# Altium project KR-Df-01-EL-00.PrjPcb (part 2 of 2)

## Sheet Power input.SchDoc: Name project title here
size A3; Organization: Krakul OÜ; Address1: Kaare tee 3, lubja; Address2: viimsi vald; Address3: harju maakond; Address4: Estonia 74010; DocumentNumber: No here; Revision: 0; SheetNumber: 4; SheetTotal: 7
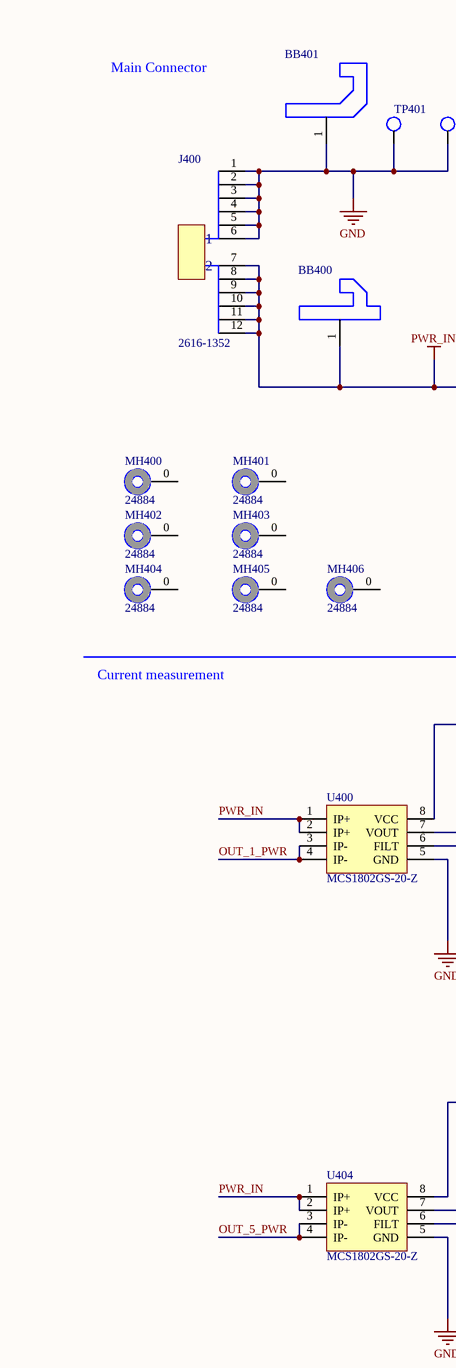
[diagram p3: Power input.SchDoc, left]
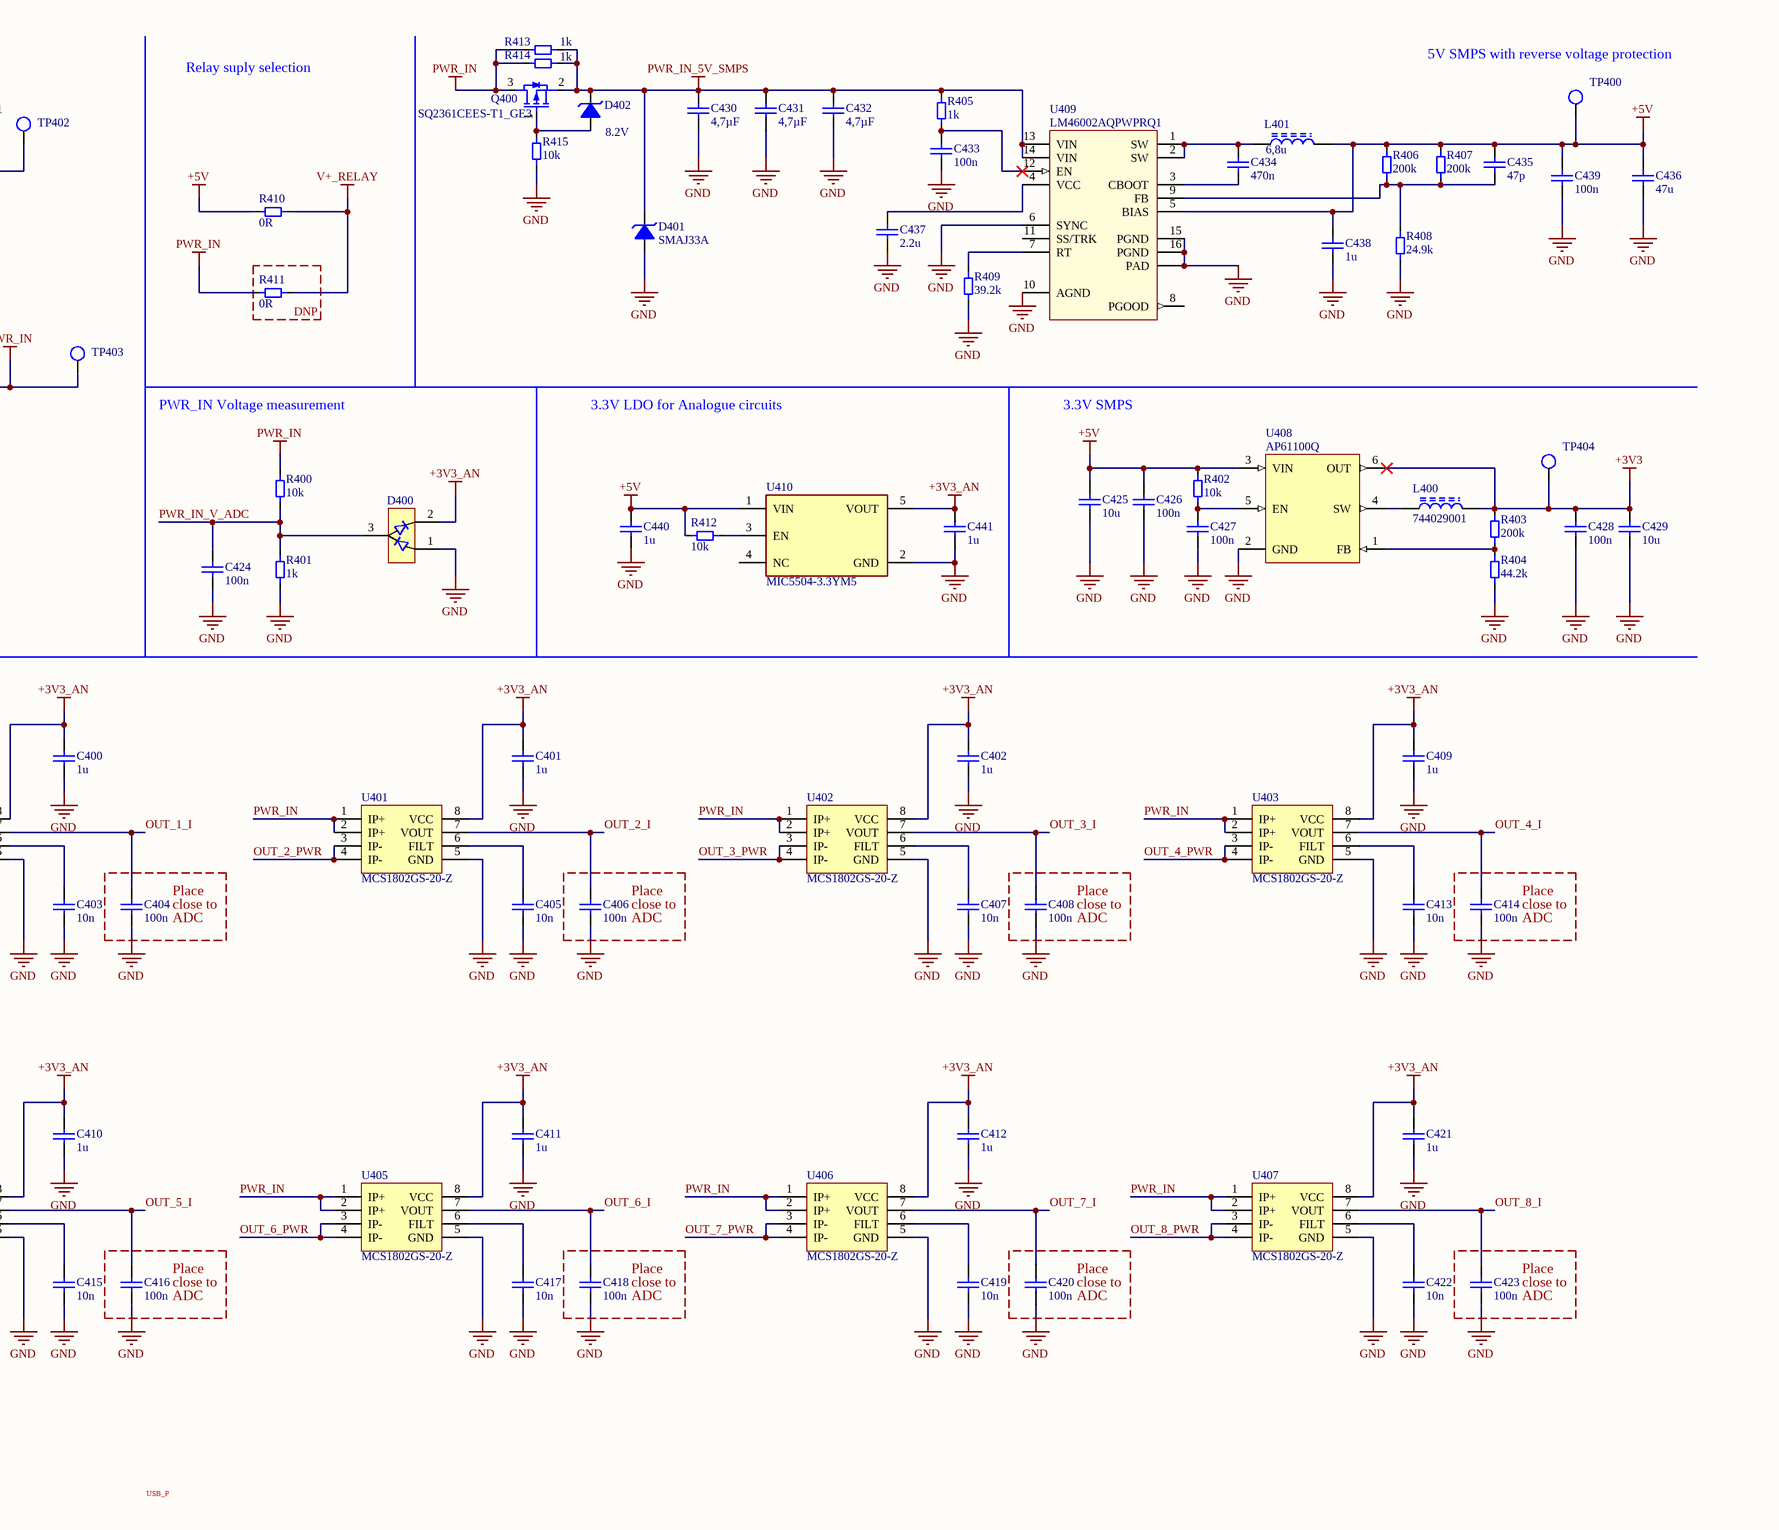
[diagram p4: Power input.SchDoc, right]

### Parts
BB400  Kr-Df-01 PWR BUSBAR  [Kr-Df-01 PWR BUSBAR footprint]  (value not drawn)
BB401  KR-Df-01 GND BUSBAR  [KR-Df-01 GND BUSBAR-Footprint-1]  (value not drawn)
C400  1u  [MLCC_0603_M]
C401  1u  [MLCC_0603_M]
C402  1u  [MLCC_0603_M]
C403  10n  [MLCC_0402_M]
C404  100n  [MLCC_0402_M]
C405  10n  [MLCC_0402_M]
C406  100n  [MLCC_0402_M]
C407  10n  [MLCC_0402_M]
C408  100n  [MLCC_0402_M]
C409  1u  [MLCC_0603_M]
C410  1u  [MLCC_0603_M]
C411  1u  [MLCC_0603_M]
C412  1u  [MLCC_0603_M]
C413  10n  [MLCC_0402_M]
C414  100n  [MLCC_0402_M]
C415  10n  [MLCC_0402_M]
C416  100n  [MLCC_0402_M]
C417  10n  [MLCC_0402_M]
C418  100n  [MLCC_0402_M]
C419  10n  [MLCC_0402_M]
C420  100n  [MLCC_0402_M]
C421  1u  [MLCC_0603_M]
C422  10n  [MLCC_0402_M]
C423  100n  [MLCC_0402_M]
C424  100n  [MLCC_0402_M]
C425  10u  [MLCC_0603_M]
C426  100n  [MLCC_0402_M]
C427  100n  [MLCC_0402_M]
C428  100n  [MLCC_0402_M]
C429  10u  [MLCC_0603_M]
C430  value 4,7µF  [MLCC_1210_M]  (hidden comment: 4.7u)
C431  value 4,7µF  [MLCC_1210_M]  (hidden comment: 4.7u)
C432  value 4,7µF  [MLCC_1210_M]  (hidden comment: 4.7u)
C433  100n  [MLCC_0402_M]
C434  470n  [MLCC_0402_M]
C435  47p  [MLCC_0402_M]
C436  47u  [MLCC_1206_M]
C437  2.2u  [MLCC_0603_M]
C438  1u  [MLCC_0603_M]
C439  100n  [MLCC_0402_M]
C440  1u  [MLCC_0603_M]
C441  1u  [MLCC_0603_M]
D400  BAT6404WH6327XTSA1  [SOT323, SC70]  (value not drawn)
D401  SMAJ33A  [FP-SMAJ-MFG]
D402  Zener Voltage: 8.2V  [SOD-323]  (hidden comment: MM3Z8V2ST1G)
J400  2616-1352  [2616-1352-Footprint-1]
L400  744029001  [744029001]
L401  value 6,8u  [SRP0420-6R8K-Footprint-1]  (hidden comment: SRP0420-6R8K)
MH400  24884  [24884-Footprint-1]
MH401  24884  [24884-Footprint-1]
MH402  24884  [24884-Footprint-1]
MH403  24884  [24884-Footprint-1]
MH404  24884  [24884-Footprint-1]
MH405  24884  [24884-Footprint-1]
MH406  24884  [24884-Footprint-1]
Q400  SQ2361CEES-T1_GE3  [3-CPH]
R400  10k  [Resistor_0603_M]
R401  1k  [Resistor_0603_M]
R402  10k  [Resistor_0603_M]
R403  200k  [Resistor_0603_M]
R404  44.2k  [Resistor_0603_M]
R405  1k  [Resistor_0402_M]
R406  200k  [Resistor_0603_M]
R407  200k  [Resistor_0603_M]
R408  24.9k  [Resistor_0402_M]
R409  39.2k  [Resistor_0402_M]
R410  Value 2: 0R  [TLRZ2BTTD-Footprint-1]  (hidden comment: TLRZ2BTTD)
R411  Value 2: 0R  [TLRZ2BTTD-Footprint-1]  (hidden comment: TLRZ2BTTD)
R412  10k  [Resistor_0603_M]
R413  1k  [Resistor_0402_M]
R414  1k  [Resistor_0402_M]
R415  10k  [Resistor_0603_M]
TP400  Testpoint 1mm  [Testpoint 1mm]  (value not drawn)  (no BOM)
TP401  Testpoint 1mm  [Testpoint 1mm]  (value not drawn)  (no BOM)
TP402  Testpoint 1mm  [Testpoint 1mm]  (value not drawn)  (no BOM)
TP403  Testpoint 1mm  [Testpoint 1mm]  (value not drawn)  (no BOM)
TP404  Testpoint 1mm  [Testpoint 1mm]  (value not drawn)  (no BOM)
U400  MCS1802GS-20-Z  [MCS1802GS-20-Z -Footprint-1]
U401  MCS1802GS-20-Z  [MCS1802GS-20-Z -Footprint-1]
U402  MCS1802GS-20-Z  [MCS1802GS-20-Z -Footprint-1]
U403  MCS1802GS-20-Z  [MCS1802GS-20-Z -Footprint-1]
U404  MCS1802GS-20-Z  [MCS1802GS-20-Z -Footprint-1]
U405  MCS1802GS-20-Z  [MCS1802GS-20-Z -Footprint-1]
U406  MCS1802GS-20-Z  [MCS1802GS-20-Z -Footprint-1]
U407  MCS1802GS-20-Z  [MCS1802GS-20-Z -Footprint-1]
U408  AP61100Q  [SOT-5X3]
U409  LM46002AQPWPRQ1  [HTSSOP-16]
U410  MIC5504-3.3YM5  [FP-SOT23-5LD-PL-1-IPC_A]

### Blocks framed on the sheet
DNP: R411

### Nets
+3V3: C428.2 C429.2 L400.2 R403.2 TP404.1 U408.6(OUT)
+3V3_AN: C400.2 C401.2 C402.2 C409.2 C410.2 C411.2 C412.2 C421.2 C441.2 D400.2 U400.8(VCC) U401.8(VCC) U402.8(VCC) U403.8(VCC) U404.8(VCC) U405.8(VCC) U406.8(VCC) U407.8(VCC) U410.5(VOUT)
+5V: C425.2 C426.2 C435.2 C436.2 C438.2 C439.2 C440.2 L401.2 R402.2 R406.2 R407.2 R410.2 R412.2 TP400.1 U408.3(VIN) U409.5(BIAS) U410.1(VIN)
GND: BB401.1(GND) C400.1 C401.1 C402.1 C403.1 C404.1 C405.1 C406.1 C407.1 C408.1 C409.1 C410.1 C411.1 C412.1 C413.1 C414.1 C415.1 C416.1 C417.1 C418.1 C419.1 C420.1 C421.1 C422.1 C423.1 C424.1 C425.1 C426.1 C427.1 C428.1 C429.1 C430.2 C431.2 C432.2 C433.2 C436.1 C437.1 C438.1 C439.1 C440.1 C441.1 D400.1 D401.2(A) J400.1 J400.2 J400.3 J400.4 J400.5 J400.6 R401.1 R404.1 R408.1 R409.1 R415.1 TP401.1 TP402.1 U400.5(GND) U401.5(GND) U402.5(GND) U403.5(GND) U404.5(GND) U405.5(GND) U406.5(GND) U407.5(GND) U408.2(GND) U409.6(SYNC) U409.10(AGND) U409.15(PGND) U409.16(PGND) U409.17(PAD) U410.2(GND)
PWR_IN: BB400.1 J400.7 J400.8 J400.9 J400.10 J400.11 J400.12 Q400.3(D) R400.2 R411.2 R413.2 R414.2 TP403.1 U400.1(IP+) U400.2(IP+) U401.1(IP+) U401.2(IP+) U402.1(IP+) U402.2(IP+) U403.1(IP+) U403.2(IP+) U404.1(IP+) U404.2(IP+) U405.1(IP+) U405.2(IP+) U406.1(IP+) U406.2(IP+) U407.1(IP+) U407.2(IP+)
PWR_IN_5V_SMPS: C430.1 C431.1 C432.1 D401.1(C) D402.1(C) Q400.2(S) R405.2 R413.1 R414.1 U409.13(VIN) U409.14(VIN)
V+_RELAY: R410.1 R411.1
OUT_1_I: C404.2 U400.7(VOUT)
OUT_1_PWR: U400.3(IP-) U400.4(IP-)
OUT_2_I: C406.2 U401.7(VOUT)
OUT_2_PWR: U401.3(IP-) U401.4(IP-)
OUT_3_I: C408.2 U402.7(VOUT)
OUT_3_PWR: U402.3(IP-) U402.4(IP-)
OUT_4_I: C414.2 U403.7(VOUT)
OUT_4_PWR: U403.3(IP-) U403.4(IP-)
OUT_5_I: C416.2 U404.7(VOUT)
OUT_5_PWR: U404.3(IP-) U404.4(IP-)
OUT_6_I: C418.2 U405.7(VOUT)
OUT_6_PWR: U405.3(IP-) U405.4(IP-)
OUT_7_I: C420.2 U406.7(VOUT)
OUT_7_PWR: U406.3(IP-) U406.4(IP-)
OUT_8_I: C423.2 U407.7(VOUT)
OUT_8_PWR: U407.3(IP-) U407.4(IP-)
PWR_IN_V_ADC: C424.2 D400.3 R400.1 R401.2
NetC403_2: C403.2 U400.6(FILT)
NetC405_2: C405.2 U401.6(FILT)
NetC407_2: C407.2 U402.6(FILT)
NetC413_2: C413.2 U403.6(FILT)
NetC415_2: C415.2 U404.6(FILT)
NetC417_2: C417.2 U405.6(FILT)
NetC419_2: C419.2 U406.6(FILT)
NetC422_2: C422.2 U407.6(FILT)
NetC427_2: C427.2 R402.1 U408.5(EN)
NetC433_1: C433.1 R405.1 U409.12(EN)
NetC434_1: C434.1 U409.3(CBOOT)
NetC434_2: C434.2 L401.1 U409.1(SW) U409.2(SW)
NetC435_1: C435.1 R406.1 R407.1 R408.2 U409.9(FB)
NetC437_2: C437.2 U409.4(VCC)
NetD402_2: D402.2(A) Q400.1(G) R415.2
NetL400_1: L400.1 U408.4(SW)
NetR403_1: R403.1 R404.2 U408.1(FB)
NetR409_2: R409.2 U409.7(RT)
NetR412_1: R412.1 U410.3(EN)

Not connected (* = marked no-connect by the designer): MH400 0(MH?); MH401 0(MH?); MH402 0(MH?); MH403 0(MH?); MH404 0(MH?); MH405 0(MH?); MH406 0(MH?); U409 8(PGOOD) 11(SS/TRK); U410 4(NC)

### Notes on the sheet
- Main Connector
- Relay suply selection
- (near TP400) 5V SMPS with reverse voltage protection
- PWR_IN Voltage measurement
- 3.3V LDO for Analogue circuits
- 3.3V SMPS
- Current measurement
- (near C404) Place
- (near C404) close to
- (near C404) ADC
- (near C406) Place
- (near C406) close to
- (near C406) ADC
- (near C408) Place
- (near C408) close to
- (near C408) ADC
- (near C414) Place
- (near C414) close to
- (near C414) ADC
- (near C416) Place
- (near C416) close to
- (near C416) ADC
- (near C418) Place
- (near C418) close to
- (near C418) ADC
- (near C420) Place
- (near C420) close to
- (near C420) ADC
- (near C423) Place
- (near C423) close to
- (near C423) ADC
- USB_P
- Title:
- Date:
- Last modified:
- Project:
- Sheet
- Time:
- of
- Size:
- A3
- Engineer:
- Revision:
- Revision date:
- Checked by:

### Library data of the parts
BB400 = CMP-ROOT-01072-9: Custom PWR busbar for DefSecIntel fuse board.; Manufacturer: Krakul; Part number: PWR_BUSBAR_1; Case/Package: Custom busbar; Mount: SMD; Pins: 1; RoHS: Yes
BB401 = CMP-ROOT-01092-5: Custom GND busbar for DefSecIntel fuse board; Manufacturer: Krakul; Part number: GND_BUSBAR_1; Case/Package: Custom busbar; Mount: SMD; Pins: 1; RoHS: Yes
C400-C402 C409-C412 C421 C438 C440 C441 = CMP-001-0642-2: MLCC, 0603, 1u, 10%, 10V, X7R; Manufacturer: Any; Capacitor Type: Ceramic; Value: 1µF; Mount: SMD; Tolerance: 10%; Case/Package: 0603; Part number: MLCC, 0603, 1u, 10%, 10V, X7R; RoHS: Yes; Voltage: 10V; Dielectric: X7R
C403 C405 C407 C413 C415 C417 C419 C422 = CMP-0001-00209-2: MLCC, 0402, 10n, 10%, 50V, X5R; Manufacturer: Any; Value: 10nF; Capacitor Type: Ceramic; Dielectric: X5R; Case/Package: 0402; Mount: SMD; Voltage: 50V; Part number: MLCC, 0402, 10n, 10%, 50V, X5R; Tolerance: 10%; RoHS: Yes
C404 C406 C408 C414 C416 C418 C420 C423 C424 C426-C428 C439 = CMP-001-1256-2: as C103 on sheet Power outputs; Case/Package: 0402; Part number: MLCC, 0402, 100n, 10%, 10V, X5R; RoHS: Yes; Tolerance: 10%; Mount: SMD; Voltage: 10V; Dielectric: X5R
C425 C429 = CMP-001-1355-1: MLCC, 0603, 10u, 10%, 25V, X5R; Manufacturer: Any; Value: 10µF; Capacitor Type: Ceramic; Voltage: 25V; Dielectric: X5R; Case/Package: 0603; Part number: MLCC, 0603, 10u, 10%, 25V, X5R; RoHS: Yes; Mount: SMD
C430-C432 = CMP-001-1296-1: MLCC, 1210, 4.7u, 10%, 100V, X7S; Manufacturer: Any; Capacitor Type: Ceramic; Capacitance: 4.7uF; Voltage Rating: 100V; Case Code (Metric): 3225; Case/Package: 1210; Min Operating Temperature: -55°C; Voltage: 100V; Mount: Surface Mount; Tolerance: 10%; Part number: MLCC, 1210, 4.7u, 10%, 100V, X7S; Packaging: Tape and Reel; Case Code (Imperial): 1210; RoHS: Yes; Dielectric: X7S; Max Operating Temperature: 125°C
C433 = CMP-0001-00196-2: MLCC, 0402, 100n, 10%, 50V, X7R; Manufacturer: Any; Value: 100nF; Capacitor Type: Ceramic; Part number: MLCC, 0402, 100n, 10%, 50V, X7R; Mount: SMD; Voltage: 50V; RoHS: Yes; Dielectric: X7R; Tolerance: 10%; Case/Package: 0402
C434 = CMP-0001-00217-2: MLCC, 0402, 470n, 10%, 50V, X5R; Manufacturer: Any; Capacitor Type: Ceramic; Value: 470nF; Dielectric: X5R; Mount: SMD; RoHS: Yes; Case/Package: 0402; Part number: MLCC, 0402, 470n, 10%, 50V, X5R; Voltage: 50V; Tolerance: 10%
C435 = CMP-0001-00149-2: MLCC, 0402, 47p, 10%, 50V, X7R; Manufacturer: Any; Capacitor Type: Ceramic; Value: 47pF; Tolerance: 10%; Case/Package: 0402; Dielectric: X7R; Mount: SMD; Voltage: 50V; RoHS: Yes; Part number: MLCC, 0402, 47p, 10%, 50V, X7R
C436 = CMP-001-1106-2: MLCC, 1206, 47u, 10%, 10V, X5R; Manufacturer: Any; Value: 47µF; Capacitor Type: Ceramic; Dielectric: X5R; Mount: SMD; Part number: MLCC, 1206, 47u, 10%, 10V, X5R; Tolerance: 10%; RoHS: Yes; Case/Package: 1206; Voltage: 10V
C437 = CMP-001-1459-1: MLCC, 0603, 2.2u, 10%, 16V, X5R; Manufacturer: Any; Capacitor Type: Ceramic; Value: 2.2µF; RoHS: Yes; Dielectric: X5R; Part number: MLCC, 0603, 2.2u, 10%, 16V, X5R; Case/Package: 0603; Tolerance: 10%; Voltage: 16V; Mount: SMD
D400 = CMP-ROOT-00071-1: Diode Array 1 Pair Series Connection Schottky 40V 120mA Surface Mount SC-70, SOT-323; Manufacturer: Infineon; Peak Non-Repetitive Surge Current: 800mA; Forward Current: 250mA; Forward Voltage: 750mV; Reverse Recovery Time: 5ns; RoHS: Yes; Radiation Hardening: No; Halogen Free: Halogen Free; Case/Package: SOT-323; Number of Pins: 3; Max Reverse Voltage (DC): 40V; Max Repetitive Reverse Voltage (Vrrm): 40V; Mount: Surface Mount; Average Rectified Current: 120mA; Max Operating Temperature: 150°C; Lead Free: Lead Free; Min Operating Temperature: -55°C; Part number: BAT6404WH6327XTSA1; Packaging: Tape and Reel; Pins: 3
D401 = CMP-ROOT-01076-1: SMAJ Series 53.3 V 0.4 kW Surface Mount Uni-Directional TVS Diode - DO-214AC; Manufacturer: Littelfuse; Clamping Voltage: 53.3V; Diode Type: ZENER; Direction: Unidirectional; Leakage Current: 1uA; Max Breakdown Voltage: 40.6V; Max Power Dissipation: 3.3W; Min Breakdown Voltage: 36.7V; Number of Elements: 1; Peak Pulse Current: 7.5A; Peak Pulse Power: 400W; Power Line Protection: No; Reverse Standoff Voltage: 33V; Test Current: 1mA; Case/Package: DO-214AC; Mount: SMD; Part number: SMAJ33A; Pins: 2; RoHS: Yes; Clamping Voltage-Max: 53.3V; Height: 2.087mm; Lead Free: Lead Free; Length: 4.5mm; Max Operating Temperature: 150°C; Max Reverse Leakage Current: 1uA; Min Operating Temperature: -65°C; Mounting Technology: Surface Mount; Number of Unidirectional Channels: 1; Packaging: Tape and Reel; Polarity: Unidirectional; Power Dissipation: 400W; Reach SVHC Compliant: Unknown; Reverse Breakdown Voltage: 36.7V; RoHS Compliant: Yes; Series: SMAJ; Voltage Rating (DC): 33V; Width: 2.79mm
D402 = CMP-ROOT-00931-1: MM3Z8V2ST1 Series 200 mW 10 mA 8.2 V SMT Zener Voltage Regulator - SOD-323; Manufacturer: onsemi; Element Configuration: Single; Forward Voltage: 900mV; Impedance: 15R; Material: Plastic; Max Power Dissipation: 200mW; Max Reverse Current: 700nA; Test Current: 5mA; Tolerance: 2%; Zener Current: 10mA; Case/Package: SOD-323-2; Mount: SMD; Part number: MM3Z8V2ST1G; RoHS: Yes; Height: 1mm; Lead Free: Lead Free; Length: 1.8mm; Max Operating Temperature: 150°C; Max Reverse Leakage Current: 700nA; Min Operating Temperature: -65°C; Number of Pins: 2; Package Quantity: 3000; Packaging: Tape and Reel; Power Dissipation: 200mW; Power Rating: 200mW; Radiation Hardening: No; Reach SVHC Compliant: Yes; RoHS Compliant: Yes; Series: -; Voltage Rating (DC): 8.2V; Voltage Tolerance: 2%; Width: 1.35mm; Working Voltage: 8.2V
J400 = CMP-ROOT-01061-1: Lever actuated terminal block, Wire-to-board. 78A, 300V, 4-18 AWG; Manufacturer: WAGO; Mount: TH; Part number: 2616-1352; Pins: 2; RoHS: Yes; Housing Color: Grey
L400 = CMP-ROOT-00305-1: 1µH Shielded Wirewound Inductor 2.2A 55mOhm Max Nonstandard; Manufacturer: Wurth Electronics Inc.; DC Resistance (DCR): 55mR; Inductance: 1uH; Value: 1uH; Test Frequency: 100kHz; Inductance Tolerance: 30%; Saturation Current: 1.6A; Self Resonant Frequency: 150MHz; Core Material: Ferrite; Max DC Current: 2.5A; RoHS: Yes; Number of Pins: 2; Width: 2.8mm; Height: 1.35mm; Length: 2.8mm; Current Rating: 2.2A; Termination: SMD/SMT; Packaging: Cut Tape; Height - Seated (Max): 0.059inch; Part number: 744029001; Composition: Wirewound; Case/Package: Nonstandard; Depth: 2.8mm; Mount: Surface Mount; REACH SVHC: Unknown; RMS Current (Irms): 2.2A; Package Quantity: 1200; Weight: 0.001129oz; Max Operating Temperature: 125°C; Min Operating Temperature: -40°C; Tolerance: 30%; Shielding: Shielded
L401 = CMP-ROOT-01075-2: Inductor Power Shielded Wirewound 6.8uH 10% 100KHz 27Q-Factor Metal Alloy Powder 2.6A 0.117Ohm DCR T/R; Manufacturer: Bourns; Case/Package: 4x4mm; Mount: SMD; Part number: SRP0420-6R8K; Pins: 2; RoHS: Yes
MH400-MH406 = CMP-ROOT-01125-5: Standoffs & Spacers SM Standoff Steel 650 pcs per reel; Manufacturer: Keystone Electronics; Plating: Tin; Threaded/Unthreaded: Threaded; Case/Package: -; Mount: SMD; Part number: 24884; RoHS: Yes; Material: Steel; Series: -
Q400 = CMP-ROOT-01117-1: P-Channel 60V 2,8A SOT-23-3; Manufacturer: Vishay; Case/Package: SOT-23-3; Mount: SMD; Part number: SQ2361CEES-T1_GE3; Pins: 3; RoHS: Yes
R400 R402 R412 R415 = CMP-001-0101-2: as R108 on sheet Power outputs; Tolerance: 1%; Value: 10k; RoHS: Yes; Mount: SMD; Case/Package: 0603; Part number: Resistor, 0603, 10k, 1%, 1/10W
R401 = CMP-0001-00237-1: as R135 on sheet Power outputs; Mount: SMD; Part number: Any; RoHS: Yes; Case/Package: 0603; Value: 1k
R403 R406 R407 = CMP-001-0132-2: Resistor, 0603, 200k, 1%, 1/10W; Manufacturer: Any; Power: 100mW; Case/Package: 0603; Mount: SMD; Part number: Resistor, 0603, 200k, 1%, 1/10W; Value: 200k; RoHS: Yes; Tolerance: 1%
R404 = CMP-001-1616-1: Resistor, 0603, 44.2k, 0.1%, 1/10W; Manufacturer: Any; Power: 100mW; RoHS: Yes; Case/Package: 0603; Mount: SMD; Value: 44.2k; Part number: Resistor, 0603, 44.2k, 0.1%, 1/10W; Tolerance: 0.1%
R405 R413 R414 = CMP-001-0340-2: Resistor, 0402, 1k, 1%, 1/16W; Manufacturer: Any; Power: 62mW; Value: 1k; Case/Package: 0402; Mount: SMD; Tolerance: 1%; RoHS: Yes; Part number: Resistor, 0402, 1k, 1%, 1/16W
R408 = CMP-0001-00027-1: Resistor, 0402, 24.9k, 1%, 1/10W; Manufacturer: Any; Case/Package: 0402; Mount: SMD; RoHS: Yes; Part number: Any; Value: 24.9k
R409 = CMP-0001-00015-2: Resistor, 0402, 39.2k, 1%, 1/10W; Manufacturer: Any; Case/Package: 0402; Value: 39.2k; Mount: SMD; Part number: Resistor, 0402, 39.2k, 1%, 1/10W; RoHS: Yes
R410 R411 = CMP-0001-00276-2: Res Metal Plate 1206 0 Ohm Sulfur Resistant Pad SMD Automotive T/R; Manufacturer: KOA Speer Electronics; Current: 50A; Value: 0; Case/Package: 1206; Mount: SMD; Part number: TLRZ2BTTD; Pins: 2; RoHS: Yes; Case Code (Imperial): 1206; Case Code (Metric): 3216; Features: Automotive AEC-Q200; Max Operating Temperature: 170°C; Min Operating Temperature: -55°C; Number of Terminations: 2; Packaging: Cut Tape; Ratings: AEC-Q200; RoHS Compliant: Yes; Series: TLRZ
TP400-TP404 = CMP-001-1238-1
U400-U407 = CMP-ROOT-01063-2: Hall Effect-Based Linear Current Sensor IC ±20A 66mV/A 100kHz 8-Pin SOIC T/R; Manufacturer: MPS; Case/Package: SOIC-8; Mount: SMD; Part number: MCS1802GS-20-Z; Pins: 8; RoHS: Yes; Sensitivity: 66mV/A
U408 = CMP-ROOT-00784-1: Switching Voltage Regulators DCDC Conv LV Buck SOT563 T&R 3K; Part number: AP61102Z6-7; Manufacturer: Diodes Incorporated; Mount: SMD; Case/Package: SOT-563-6; RoHS: Yes
U409 = CMP-ROOT-00198-2: Manufacturer: Texas Instruments; Min Output Voltage: 1V; Min Input Voltage: 3.5V; Output Type: Adjustable; Output Current: 2A; Number of Outputs: 1; Switching Frequency: 2.2MHz; Max Input Voltage: 60V; Synchronous Rectifier: Yes; Output Configuration: Positive; Max Output Voltage: 28V; Packaging: Tape and Reel; Min Operating Temperature: -40°C; RoHS: Yes; Part number: LM46002AQPWPRQ1; Pins: 16; Mount: Surface Mount; Case/Package: 16HTSSOP; Max Operating Temperature: 125°C
U410 = CMP-ROOT-00999-4: 3.3V 300mA LDO; Manufacturer: Microchip Technology; Case/Package: SOT23-5; Mount: SMD; Part number: MIC5504-3.3YM5; Pins: 5; RoHS: Yes

## Sheet MCU.SchDoc: Name project title here
size A3; Organization: Krakul OÜ; Address1: Kaare tee 3, lubja; Address2: viimsi vald; Address3: harju maakond; Address4: Estonia 74010; DocumentNumber: No here; Revision: 0; SheetNumber: 5; SheetTotal: 7
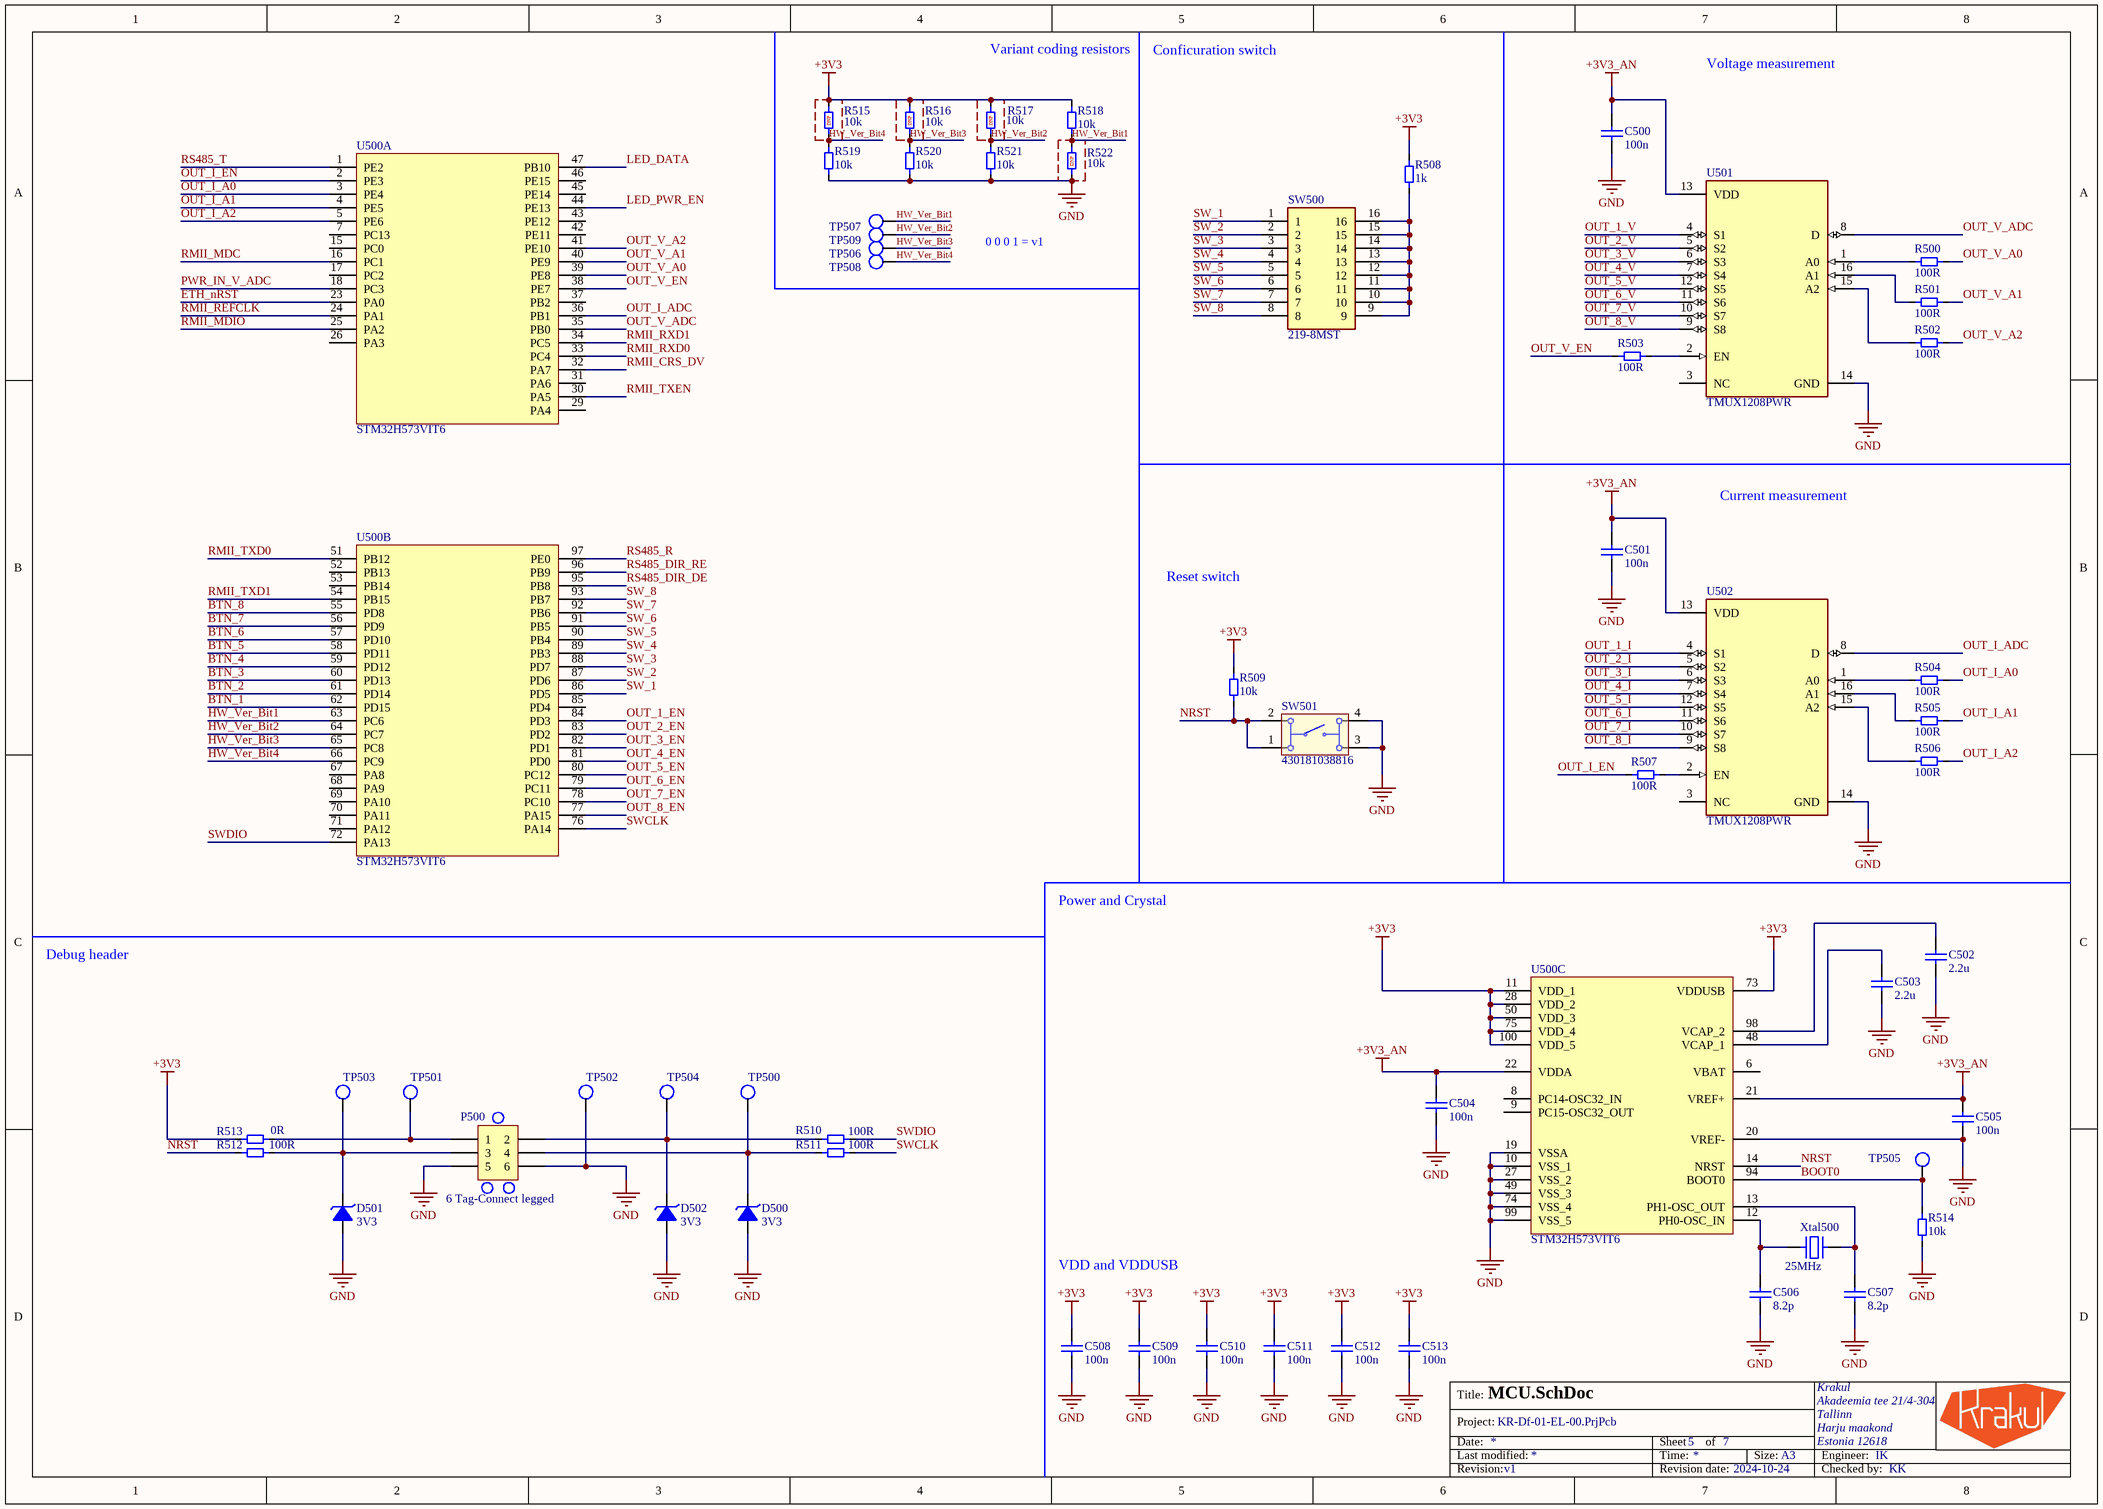
[diagram p5: MCU.SchDoc]

### Parts
C500  100n  [MLCC_0402_M]
C501  100n  [MLCC_0402_M]
C502  2.2u  [MLCC_0603_M]
C503  2.2u  [MLCC_0603_M]
C504  100n  [MLCC_0402_M]
C505  100n  [MLCC_0402_M]
C506  8.2p  [MLCC_0402_M]
C507  8.2p  [MLCC_0402_M]
C508  100n  [MLCC_0402_M]
C509  100n  [MLCC_0402_M]
C510  100n  [MLCC_0402_M]
C511  100n  [MLCC_0402_M]
C512  100n  [MLCC_0402_M]
C513  100n  [MLCC_0402_M]
D500  3V3  [SOD-923]
D501  3V3  [SOD-923]
D502  3V3  [SOD-923]
P500  6 Tag-Connect legged  [6P TAG-CONN legged]
R500  100R  [Resistor_0603_M]
R501  100R  [Resistor_0603_M]
R502  100R  [Resistor_0603_M]
R503  100R  [Resistor_0603_M]
R504  100R  [Resistor_0603_M]
R505  100R  [Resistor_0603_M]
R506  100R  [Resistor_0603_M]
R507  100R  [Resistor_0603_M]
R508  1k  [Resistor_0603_M]
R509  10k  [Resistor_0603_M]
R510  100R  [Resistor_0603_M]
R511  100R  [Resistor_0603_M]
R512  100R  [Resistor_0603_M]
R513  Value 2: 0R  [TLRZ2BTTD-Footprint-1]  (hidden comment: TLRZ2BTTD)
R514  10k  [Resistor_0603_M]
R515  10k  [Resistor_0603_M]
R516  10k  [Resistor_0603_M]
R517  10k  [Resistor_0603_M]
R518  10k  [Resistor_0603_M]
R519  10k  [Resistor_0603_M]
R520  10k  [Resistor_0603_M]
R521  10k  [Resistor_0603_M]
R522  10k  [Resistor_0603_M]
SW500  219-8MST  [219-8MST-Footprint-1]
SW501  430181038816  [430181038816]
TP500  Testpoint 1mm  [Testpoint 1mm]  (value not drawn)  (no BOM)
TP501  Testpoint 1mm  [Testpoint 1mm]  (value not drawn)  (no BOM)
TP502  Testpoint 1mm  [Testpoint 1mm]  (value not drawn)  (no BOM)
TP503  Testpoint 1mm  [Testpoint 1mm]  (value not drawn)  (no BOM)
TP504  Testpoint 1mm  [Testpoint 1mm]  (value not drawn)  (no BOM)
TP505  Testpoint 1mm  [Testpoint 1mm]  (value not drawn)  (no BOM)
TP506  Testpoint 1mm  [Testpoint 1mm]  (value not drawn)  (no BOM)
TP507  Testpoint 1mm  [Testpoint 1mm]  (value not drawn)  (no BOM)
TP508  Testpoint 1mm  [Testpoint 1mm]  (value not drawn)  (no BOM)
TP509  Testpoint 1mm  [Testpoint 1mm]  (value not drawn)  (no BOM)
U500  STM32H573VIT6  [STM32H573VIT6-Footprint-1]  (parts A,B,C of 3)
U501  TMUX1208PWR  [FP-PW0016A-IPC_B]
U502  TMUX1208PWR  [FP-PW0016A-IPC_B]
Xtal500  Frequency: 25MHz  [4-SMD Crystal 2.00mm x 1.60mm]  (hidden comment: ECS-250-10-37B-CTN-TR)

### Nets
+3V3: C508.2 C509.2 C510.2 C511.2 C512.2 C513.2 R508.2 R509.2 R513.2 R515.1 R516.2 R517.2 R518.2 U500.11(VDD_1) U500.28(VDD_2) U500.50(VDD_3) U500.73(VDDUSB) U500.75(VDD_4) U500.100(VDD_5)
+3V3_AN: C500.2 C501.2 C504.2 C505.2 U500.21(VREF+) U500.22(VDDA) U501.13(VDD) U502.13(VDD)
GND: C500.1 C501.1 C502.1 C503.1 C504.1 C505.1 C506.1 C507.1 C508.1 C509.1 C510.1 C511.1 C512.1 C513.1 D500.2(A) D501.2(A) D502.2(A) P500.5 P500.6 R514.1 R519.1 R520.1 R521.1 R522.1 SW501.3 SW501.4 TP502.1 U500.10(VSS_1) U500.19(VSSA) U500.20(VREF-) U500.27(VSS_2) U500.49(VSS_3) U500.74(VSS_4) U500.99(VSS_5) U501.14(GND) U502.14(GND) Xtal500.2(GND) Xtal500.4(GND)
BOOT0: R514.2 TP505.1 U500.94(BOOT0)
BTN_1: U500.62(PD15)
BTN_2: U500.61(PD14)
BTN_3: U500.60(PD13)
BTN_4: U500.59(PD12)
BTN_5: U500.58(PD11)
BTN_6: U500.57(PD10)
BTN_7: U500.56(PD9)
BTN_8: U500.55(PD8)
ETH_nRST: U500.23(PA0)
HW_Ver_Bit1: R518.1 R522.2 TP507.1 U500.63(PC6)
HW_Ver_Bit2: R517.1 R521.2 TP509.1 U500.64(PC7)
HW_Ver_Bit3: R516.1 R520.2 TP506.1 U500.65(PC8)
HW_Ver_Bit4: R515.2 R519.2 TP508.1 U500.66(PC9)
LED_DATA: U500.47(PB10)
LED_PWR_EN: U500.44(PE13)
NRST: R509.1 R512.2 SW501.1 SW501.2 U500.14(NRST)
OUT_1_EN: U500.84(PD3)
OUT_1_I: U502.4(S1)
OUT_1_V: U501.4(S1)
OUT_2_EN: U500.83(PD2)
OUT_2_I: U502.5(S2)
OUT_2_V: U501.5(S2)
OUT_3_EN: U500.82(PD1)
OUT_3_I: U502.6(S3)
OUT_3_V: U501.6(S3)
OUT_4_EN: U500.81(PD0)
OUT_4_I: U502.7(S4)
OUT_4_V: U501.7(S4)
OUT_5_EN: U500.80(PC12)
OUT_5_I: U502.12(S5)
OUT_5_V: U501.12(S5)
OUT_6_EN: U500.79(PC11)
OUT_6_I: U502.11(S6)
OUT_6_V: U501.11(S6)
OUT_7_EN: U500.78(PC10)
OUT_7_I: U502.10(S7)
OUT_7_V: U501.10(S7)
OUT_8_EN: U500.77(PA15)
OUT_8_I: U502.9(S8)
OUT_8_V: U501.9(S8)
OUT_I_A0: R504.2 U500.3(PE4)
OUT_I_A1: R505.2 U500.4(PE5)
OUT_I_A2: R506.2 U500.5(PE6)
OUT_I_ADC: U500.36(PB1) U502.8(D)
OUT_I_EN: R507.1 U500.2(PE3)
OUT_V_A0: R500.2 U500.39(PE8)
OUT_V_A1: R501.2 U500.40(PE9)
OUT_V_A2: R502.2 U500.41(PE10)
OUT_V_ADC: U500.35(PB0) U501.8(D)
OUT_V_EN: R503.1 U500.38(PE7)
PWR_IN_V_ADC: U500.18(PC3)
RMII_CRS_DV: U500.32(PA7)
RMII_MDC: U500.16(PC1)
RMII_MDIO: U500.25(PA2)
RMII_REFCLK: U500.24(PA1)
RMII_RXD0: U500.33(PC4)
RMII_RXD1: U500.34(PC5)
RMII_TXD0: U500.51(PB12)
RMII_TXD1: U500.54(PB15)
RMII_TXEN: U500.30(PA5)
RS485_DIR_DE: U500.95(PB8)
RS485_DIR_RE: U500.96(PB9)
RS485_R: U500.97(PE0)
RS485_T: U500.1(PE2)
SW_1: SW500.1 U500.86(PD5)
SW_2: SW500.2 U500.87(PD6)
SW_3: SW500.3 U500.88(PD7)
SW_4: SW500.4 U500.89(PB3)
SW_5: SW500.5 U500.90(PB4)
SW_6: SW500.6 U500.91(PB5)
SW_7: SW500.7 U500.92(PB6)
SW_8: SW500.8 U500.93(PB7)
SWCLK: R511.1 U500.76(PA14)
SWDIO: R510.2 U500.72(PA13)
NetC502_2: C502.2 U500.98(VCAP_2)
NetC503_2: C503.2 U500.48(VCAP_1)
NetC506_2: C506.2 U500.12(PH0-OSC_IN) Xtal500.1
NetC507_2: C507.2 U500.13(PH1-OSC_OUT) Xtal500.3
NetD500_1: D500.1(C) P500.4 R511.2 TP500.1
NetD501_1: D501.1(C) P500.3 R512.1 TP503.1
NetD502_1: D502.1(C) P500.2 R510.1 TP504.1
NetP500_1: P500.1 R513.1 TP501.1
NetR500_1: R500.1 U501.1(A0)
NetR501_1: R501.1 U501.16(A1)
NetR502_1: R502.1 U501.15(A2)
NetR503_2: R503.2 U501.2(EN)
NetR504_1: R504.1 U502.1(A0)
NetR505_1: R505.1 U502.16(A1)
NetR506_1: R506.1 U502.15(A2)
NetR507_2: R507.2 U502.2(EN)
NetR508_1: R508.1 SW500.9 SW500.10 SW500.11 SW500.12 SW500.13 SW500.14 SW500.15 SW500.16

Not connected (* = marked no-connect by the designer): U500 6(VBAT) 7(PC13) 8(PC14-OSC32_IN) 9(PC15-OSC32_OUT) 15(PC0) 17(PC2) 26(PA3) 29(PA4) 31(PA6) 37(PB2) 42(PE11) 43(PE12) 45(PE14) 46(PE15) 52(PB13) 53(PB14) 67(PA8) 68(PA9) 69(PA10) 70(PA11) 71(PA12) 85(PD4); U501 3(NC); U502 3(NC)

### Notes on the sheet
- Variant coding resistors
- Conficuration switch
- Voltage measurement
- (near R515) DNP
- (near R516) DNP
- (near R517) DNP
- (near R522) DNP
- 0 0 0 1 = v1
- Current measurement
- Reset switch
- Power and Crystal
- Debug header
- VDD and VDDUSB
- Title:
- Date:
- Last modified:
- Project:
- Sheet
- Time:
- of
- Size:
- A3
- Engineer:
- Revision:
- Revision date:
- Checked by:

### Library data of the parts
C500 C501 C504 C505 C508-C513 = CMP-001-1256-2: as C103 on sheet Power outputs; Case/Package: 0402; Part number: MLCC, 0402, 100n, 10%, 10V, X5R; RoHS: Yes; Tolerance: 10%; Mount: SMD; Voltage: 10V; Dielectric: X5R
C502 C503 = CMP-001-1459-1: as C437 on sheet Power input; RoHS: Yes; Dielectric: X5R; Part number: MLCC, 0603, 2.2u, 10%, 16V, X5R; Case/Package: 0603; Tolerance: 10%; Voltage: 16V; Mount: SMD
C506 C507 = CMP-0001-00091-2: MLCC, 0402, 8.2p, 5%, 50V, C0G/NP0; Manufacturer: Any; Value: 8.2pF; Capacitor Type: Ceramic; Part number: MLCC, 0402, 8.2p, 5%, 50V, C0G/NP0; Voltage: 50V; Mount: SMD; Tolerance: 5%; Case/Package: 0402; RoHS: Yes; Dielectric: C0G/NP0
D500-D502 = CMP-001-1298-2: TVS DIODE 3.3V SOD923; Part number: ESD9X3.3ST5G; Manufacturer: ON Semiconductor; Number of Channels: 1; Polarity: Unidirectional; Clamping Voltage: 10.4V; Test Current: 1mA; Element Configuration: Single; Max Power Dissipation: 150mW; Peak Pulse Current: 9.8A; Max Breakdown Voltage: 5V; Capacitance: 80pF; Leakage Current: 2.5uA; Peak Pulse Power: 102W; ESD Protection: Yes; Power Line Protection: No; Operating Supply Voltage: 3.3V; Packaging: Tape and Reel; Working Voltage: 3.3V; Direction: Unidirectional; Width: 0.65mm; Number of Pins: 2; Max Operating Temperature: 150°C; REACH SVHC: No SVHC; Length: 0.8mm; Halogen Free: Halogen Free; Package Quantity: 1; Mount: Surface Mount; Number of Lines: 1; Number of Unidirectional Channels: 1; Pins: 2; Contact Plating: Tin,Matte; Depth: 0.6mm; Termination: SMD/SMT; Lead Free: Lead Free; Reverse Standoff Voltage: 3.3V; Min Operating Temperature: -55°C; Composition: Zener; RoHS: Yes; Case/Package: SOD-923-2; Reverse Breakdown Voltage: 5V; Max Surge Current: 9.8A; Number of Elements: 1; Height: 0.43mm; Breakdown Voltage: 5V; Radiation Hardening: No; Min Breakdown Voltage: 5V; Max Reverse Leakage Current: 2.5uA; Number of Circuits: 1
P500 = CMP-001-1441-5: 6 Pin Tag-Connect legged; Manufacturer: Tag-Connect; RoHS: Yes; Mount: TH; Part number: 6pin Tag-Connect legged
R500-R507 R510-R512 = CMP-001-0053-3: as R106 on sheet Power outputs; RoHS: Yes; Case/Package: 0603; Tolerance: 1%; Part number: Resistor, 0603, 100R, 1%, 1/10W; Mount: SMD
R508 = CMP-0001-00237-1: as R135 on sheet Power outputs; Mount: SMD; Part number: Any; RoHS: Yes; Case/Package: 0603; Value: 1k
R509 R514-R522 = CMP-001-0101-2: as R108 on sheet Power outputs; Tolerance: 1%; Value: 10k; RoHS: Yes; Mount: SMD; Case/Package: 0603; Part number: Resistor, 0603, 10k, 1%, 1/10W
R513 = CMP-0001-00276-2: as R410 on sheet Power input; Case/Package: 1206; Mount: SMD; Part number: TLRZ2BTTD; Pins: 2; RoHS: Yes; Case Code (Imperial): 1206; Case Code (Metric): 3216; Features: Automotive AEC-Q200; Max Operating Temperature: 170°C; Min Operating Temperature: -55°C; Number of Terminations: 2; Packaging: Cut Tape; Ratings: AEC-Q200; RoHS Compliant: Yes; Series: TLRZ
SW500 = CMP-ROOT-01070-1: Switch DIP ON OFF SPST 8 Raised Slide 0.1A 20VDC Gull Wing 2000Cycles 2.54mm SMD Tube; Manufacturer: CTS Electronic Components; Actuator Length: 0.25mm; Actuator Type: Slide (Standard); Contact Resistance: 25mR; Current Rating: 100mA; Max Voltage Rating (DC): 20V; Number of Positions: 8; Washable: Yes; Case/Package: SMD; Mount: SMD; Part number: 219-8MST; Pins: 16; RoHS: Yes; Contact Material: Copper; Contact Plating: Gold,Tin; Depth: 9.91mm; Electrical Life: 2000Cycles; Height: 4.05mm; Lead Free: Lead Free; Length: 21.79mm; Max Current Rating: 100mA; Max Operating Temperature: 85°C; Mechanical Life: 2000Cycles; Min Operating Temperature: -55°C; Mounting Technology: Surface Mount; Orientation: Straight; Package Quantity: 25; Packaging: Rail/Tube; Radiation Hardening: No; RoHS Compliant: Yes; Series: 219; Terminal Pitch: 2.54mm; Termination: Gull Wing; Throw Configuration: SPST; Voltage Rating (DC): 20V
SW501 = CMP-ROOT-00883-1: Switch Tactile Spst-no 0.05A 12V; Manufacturer: Würth Elektronik; Case/Package: SMD; Part number: 430181038816; RoHS: Yes; Mount: Surface Mount
TP500-TP509 = CMP-001-1238-1
U500 = CMP-ROOT-01065-3: Armï¿½ Cortexï¿½-M33 32-bit MCU+TrusZoneï¿½ + FPU, 360 DMIPS @240MHz, 2 Mbytes Flash, 640 Kbytes RAM, Math accelerators; Manufacturer: STMicroelectronics; Case/Package: LQFP100; Mount: SMD; Part number: STM32H573VIT6; Pins: 100; RoHS: Yes
U501 U502 = CMP-ROOT-01067-2: 5-V, 8: 1, 1-channel general-purpose analog multiplexer with 1.8-V input logic 16-TSSOP -40 to 125; Manufacturer: TI; Case/Package: TSSOP-16; Mount: SMD; Part number: TMUX1208PWR; Pins: 16; RoHS: Yes
Xtal500 = CMP-001-1313-1: 25MHz ±10ppm Crystal 10pF 50 Ohms 4-SMD, No Lead; Manufacturer: ECS Inc.; Case/Package: 4-SMD 2.0x1.6; Part number: ECS-250-10-37B-CTN-TR; Pins: 4; Mount: SMD; RoHS: Yes

## Sheet LEDs_Switches.SchDoc: Name project title here
size A3; Organization: Krakul OÜ; Address1: Kaare tee 3, lubja; Address2: viimsi vald; Address3: harju maakond; Address4: Estonia 74010; DocumentNumber: No here; Revision: 0; SheetNumber: 6; SheetTotal: 7
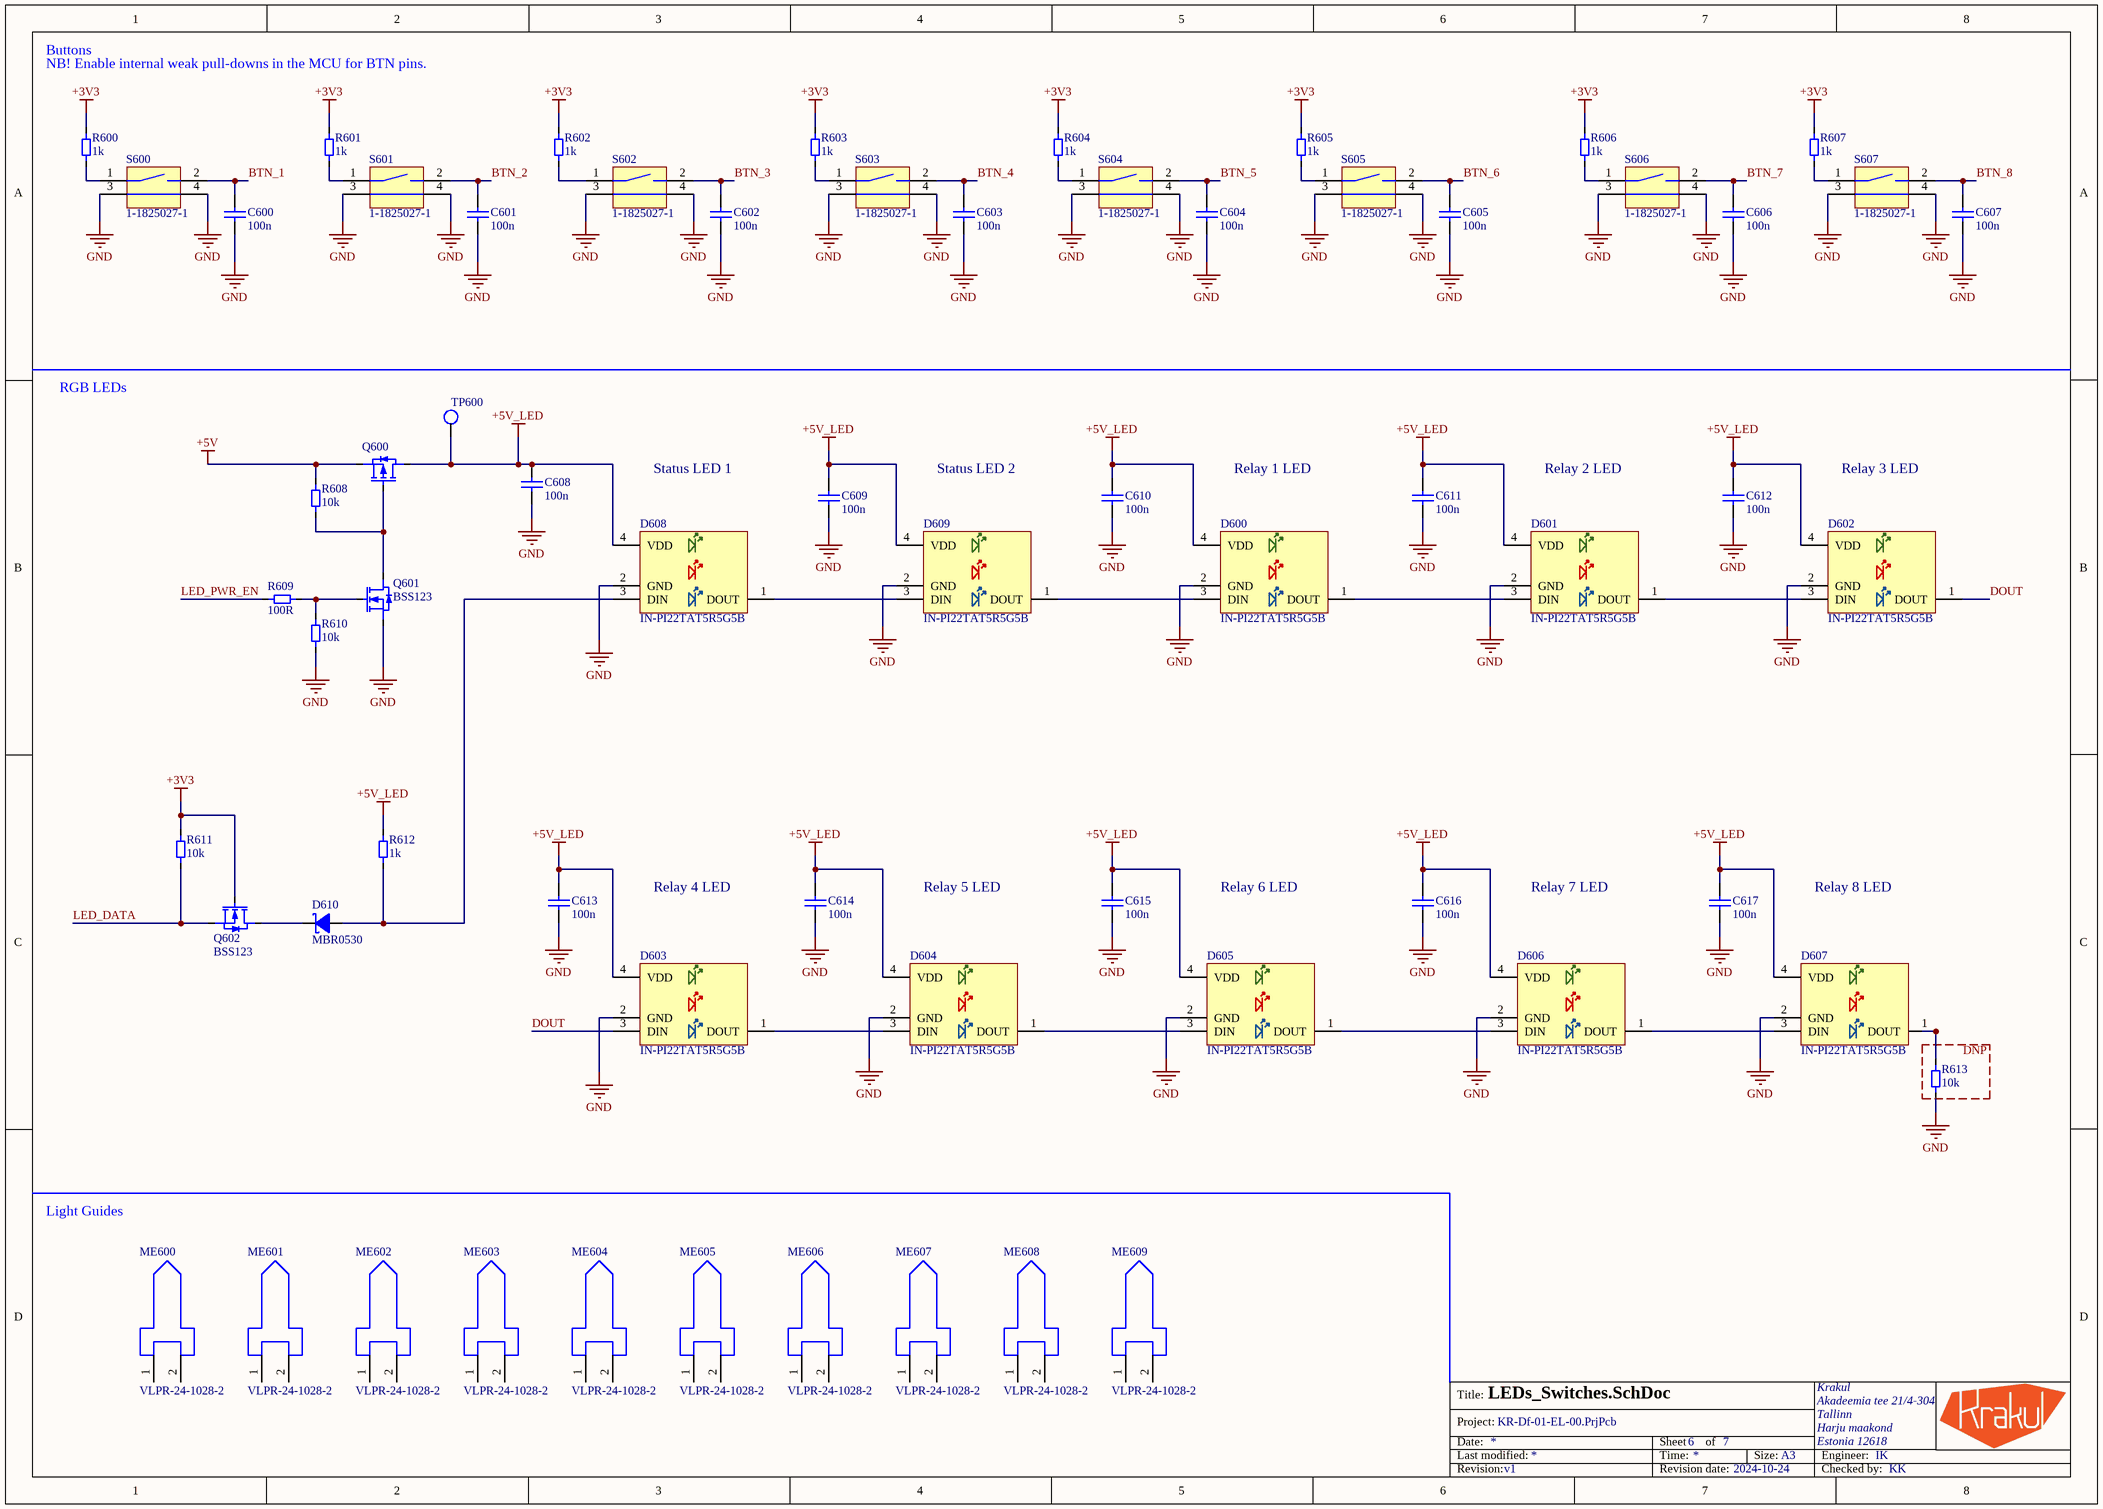
[diagram p6: LEDs_Switches.SchDoc]

### Parts
C600  100n  [MLCC_0402_M]
C601  100n  [MLCC_0402_M]
C602  100n  [MLCC_0402_M]
C603  100n  [MLCC_0402_M]
C604  100n  [MLCC_0402_M]
C605  100n  [MLCC_0402_M]
C606  100n  [MLCC_0402_M]
C607  100n  [MLCC_0402_M]
C608  100n  [MLCC_0402_M]
C609  100n  [MLCC_0402_M]
C610  100n  [MLCC_0402_M]
C611  100n  [MLCC_0402_M]
C612  100n  [MLCC_0402_M]
C613  100n  [MLCC_0402_M]
C614  100n  [MLCC_0402_M]
C615  100n  [MLCC_0402_M]
C616  100n  [MLCC_0402_M]
C617  100n  [MLCC_0402_M]
D600  IN-PI22TAT5R5G5B  [IN-PI22TAT5R5G5B]
D601  IN-PI22TAT5R5G5B  [IN-PI22TAT5R5G5B]
D602  IN-PI22TAT5R5G5B  [IN-PI22TAT5R5G5B]
D603  IN-PI22TAT5R5G5B  [IN-PI22TAT5R5G5B]
D604  IN-PI22TAT5R5G5B  [IN-PI22TAT5R5G5B]
D605  IN-PI22TAT5R5G5B  [IN-PI22TAT5R5G5B]
D606  IN-PI22TAT5R5G5B  [IN-PI22TAT5R5G5B]
D607  IN-PI22TAT5R5G5B  [IN-PI22TAT5R5G5B]
D608  IN-PI22TAT5R5G5B  [IN-PI22TAT5R5G5B]
D609  IN-PI22TAT5R5G5B  [IN-PI22TAT5R5G5B]
D610  MBR0530  [SOD-123]
ME600  VLPR-24-1028-2  [VLPR-24-1028-2-Footprint-1]
ME601  VLPR-24-1028-2  [VLPR-24-1028-2-Footprint-1]
ME602  VLPR-24-1028-2  [VLPR-24-1028-2-Footprint-1]
ME603  VLPR-24-1028-2  [VLPR-24-1028-2-Footprint-1]
ME604  VLPR-24-1028-2  [VLPR-24-1028-2-Footprint-1]
ME605  VLPR-24-1028-2  [VLPR-24-1028-2-Footprint-1]
ME606  VLPR-24-1028-2  [VLPR-24-1028-2-Footprint-1]
ME607  VLPR-24-1028-2  [VLPR-24-1028-2-Footprint-1]
ME608  VLPR-24-1028-2  [VLPR-24-1028-2-Footprint-1]
ME609  VLPR-24-1028-2  [VLPR-24-1028-2-Footprint-1]
Q600  DMG2305UX-13  [SOT-23-3]  (value not drawn)
Q601  BSS123  [SOT-23-3]
Q602  BSS123  [SOT-23-3]
R600  1k  [Resistor_0603_M]
R601  1k  [Resistor_0603_M]
R602  1k  [Resistor_0603_M]
R603  1k  [Resistor_0603_M]
R604  1k  [Resistor_0603_M]
R605  1k  [Resistor_0603_M]
R606  1k  [Resistor_0603_M]
R607  1k  [Resistor_0603_M]
R608  10k  [Resistor_0603_M]
R609  100R  [Resistor_0603_M]
R610  10k  [Resistor_0603_M]
R611  10k  [Resistor_0603_M]
R612  1k  [Resistor_0603_M]
R613  10k  [Resistor_0603_M]
S600  1-1825027-1  [1-1825027-1-Footprint-1]
S601  1-1825027-1  [1-1825027-1-Footprint-1]
S602  1-1825027-1  [1-1825027-1-Footprint-1]
S603  1-1825027-1  [1-1825027-1-Footprint-1]
S604  1-1825027-1  [1-1825027-1-Footprint-1]
S605  1-1825027-1  [1-1825027-1-Footprint-1]
S606  1-1825027-1  [1-1825027-1-Footprint-1]
S607  1-1825027-1  [1-1825027-1-Footprint-1]
TP600  Testpoint 1mm  [Testpoint 1mm]  (value not drawn)  (no BOM)

### Blocks framed on the sheet
DNP: R613

### Nets
+3V3: Q602.1(G) R600.2 R601.2 R602.2 R603.2 R604.2 R605.2 R606.2 R607.2 R611.2
+5V: Q600.2(S) R608.2
+5V_LED: C608.2 C609.2 C610.2 C611.2 C612.2 C613.2 C614.2 C615.2 C616.2 C617.2 D600.4(VDD) D601.4(VDD) D602.4(VDD) D603.4(VDD) D604.4(VDD) D605.4(VDD) D606.4(VDD) D607.4(VDD) D608.4(VDD) D609.4(VDD) Q600.3(D) R612.2 TP600.1
GND: C600.1 C601.1 C602.1 C603.1 C604.1 C605.1 C606.1 C607.1 C608.1 C609.1 C610.1 C611.1 C612.1 C613.1 C614.1 C615.1 C616.1 C617.1 D600.2(GND) D601.2(GND) D602.2(GND) D603.2(GND) D604.2(GND) D605.2(GND) D606.2(GND) D607.2(GND) D608.2(GND) D609.2(GND) Q601.2(S) R610.1 R613.1 S600.3 S600.4 S601.3 S601.4 S602.3 S602.4 S603.3 S603.4 S604.3 S604.4 S605.3 S605.4 S606.3 S606.4 S607.3 S607.4
BTN_1: C600.2 S600.2
BTN_2: C601.2 S601.2
BTN_3: C602.2 S602.2
BTN_4: C603.2 S603.2
BTN_5: C604.2 S604.2
BTN_6: C605.2 S605.2
BTN_7: C606.2 S606.2
BTN_8: C607.2 S607.2
DOUT: D602.1(DOUT) D603.3(DIN)
LED_DATA: Q602.2(S) R611.1
LED_PWR_EN: R609.1
NetD600_1: D600.1(DOUT) D601.3(DIN)
NetD600_3: D600.3(DIN) D609.1(DOUT)
NetD601_1: D601.1(DOUT) D602.3(DIN)
NetD603_1: D603.1(DOUT) D604.3(DIN)
NetD604_1: D604.1(DOUT) D605.3(DIN)
NetD605_1: D605.1(DOUT) D606.3(DIN)
NetD606_1: D606.1(DOUT) D607.3(DIN)
NetD607_1: D607.1(DOUT) R613.2
NetD608_1: D608.1(DOUT) D609.3(DIN)
NetD608_3: D608.3(DIN) D610.2(A) R612.1
NetD610_1: D610.1(C) Q602.3(D)
NetQ600_1: Q600.1(G) Q601.3(D) R608.1
NetQ601_1: Q601.1(G) R609.2 R610.2
NetR600_1: R600.1 S600.1
NetR601_1: R601.1 S601.1
NetR602_1: R602.1 S602.1
NetR603_1: R603.1 S603.1
NetR604_1: R604.1 S604.1
NetR605_1: R605.1 S605.1
NetR606_1: R606.1 S606.1
NetR607_1: R607.1 S607.1

Not connected (* = marked no-connect by the designer): ME600 1 2; ME601 1 2; ME602 1 2; ME603 1 2; ME604 1 2; ME605 1 2; ME606 1 2; ME607 1 2; ME608 1 2; ME609 1 2

### Notes on the sheet
- Buttons
- NB! Enable internal weak pull-downs in the MCU for BTN pins.
- RGB LEDs
- Status LED 1
- Status LED 2
- Relay 1 LED
- Relay 2 LED
- Relay 3 LED
- Relay 4 LED
- Relay 5 LED
- Relay 6 LED
- Relay 7 LED
- Relay 8 LED
- Light Guides
- Title:
- Date:
- Last modified:
- Project:
- Sheet
- Time:
- of
- Size:
- A3
- Engineer:
- Revision:
- Revision date:
- Checked by:

### Library data of the parts
C600-C617 = CMP-001-1256-2: MLCC, 0402, 100n, 10%, 10V, X5R; Manufacturer: Any; Capacitor Type: Ceramic; Value: 100nF; Case/Package: 0402; Part number: MLCC, 0402, 100n, 10%, 10V, X5R; RoHS: Yes; Tolerance: 10%; Mount: SMD; Voltage: 10V; Dielectric: X5R
D600-D609 = CMP-001-1686-5: RGB LED, Discrete, Serial PWM(1Wire); Manufacturer: Inolux; Color: Blue,Green,Red; Number of LEDs: 1; Case/Package: SMD/SMT; Mount: SMD; Part number: IN-PI22TAT5R5G5B; Pins: 4; RoHS: Yes; Interface: Serial; Length: 2.7mm; Mounting Technology: Surface Mount; Packaging: Cut Tape; Series: -; Width: 2.4mm; Datasheet: https://www.inolux-corp.com/datasheet/SMDLED/Addressable%20LED/IN-PI22TAT5R5G5B_v1.2.pdf
D610 = CMP-ROOT-00224-1: Diode Schottky 30V 500mA Surface Mount SOD-123; Manufacturer: ON Semiconductor; Peak Reverse Current: 130uA; Element Configuration: Single; Max Forward Surge Current (Ifsm): 5.5A; Forward Voltage: 430mV; Polarity: Standard; Pins: 2; Average Rectified Current: 500mA; Voltage Rating (DC): 30V; Max Operating Temperature: 150°C; Height: 1.03mm; Part number: MBR0530; Weight: 0.03g; Width: 1.6mm; Max Repetitive Reverse Voltage (Vrrm): 30V; RoHS: Yes; Length: 2.7mm; Mount: Surface Mount; Contact Plating: Tin,Matte; Output Current: 500mA; Max Reverse Leakage Current: 130uA; Forward Current: 500mA; Max Reverse Voltage (DC): 30V; Max Surge Current: 5.5A; Min Operating Temperature: -65°C; Peak Non-Repetitive Surge Current: 5.5A; Radiation Hardening: No; Case/Package: SOD-123; REACH SVHC: No SVHC; Packaging: Tape and Reel; Package Quantity: 1; Lead Free: Lead Free; Current Rating: 500mA; Number of Pins: 2
ME600-ME609 = CMP-ROOT-01098-2: Light Pipe, Rigid, Vertical, Board Mount, Smd Led, 1.028 In., 4 Mm X 2 Mm Rectangular Face; Manufacturer: Bivar; Body Length: 26.1mm; Number of Columns: 1; Case/Package: SMD/SMT; Mount: TH; Part number: VLPR-24-1028-2; RoHS: Yes; Color: Clear; Lead Free: Lead Free; Length: 26.1mm; Material: PC,Polycarbonate; Mounting Technology: Press-Fit,Board,PCB; Number of Rows: 1; Number of Ways: 1; Orientation: Vertical; Package Quantity: 100; Packaging: Bulk; Series: VLPR; Size: 1.058inch
Q600 = CMP-ROOT-00017-1: P-Channel 20V 4.2A (Ta) 1.4W (Ta) Surface Mount SOT-23; Manufacturer: Diodes Incorporated; Drain to Source Breakdown Voltage: -20V; Drain to Source Resistance: 52mR; Fall Time: 34.7ns; Input Capacitance: 808pF; Rise Time: 13.7ns; Element Configuration: Single; Turn-Off Delay Time: 79.3ns; Threshold Voltage: -900mV; On-State Resistance: 65MR; Turn-On Delay Time: 10.8ns; Number of Channels: 1; Gate to Source Voltage (Vgs): 8V; Case/Package: SOT-23; Mount: Surface Mount; Package Quantity: 1; Max Power Dissipation: 1.4W; Length: 3mm; Continuous Drain Current (ID): 4.2A; Weight: 0.000282oz; REACH SVHC: No SVHC; Height: 1.1mm; Lead Free: Lead Free; Min Operating Temperature: -55°C; Rds On Max: 52mR; Packaging: Tape and Reel; Radiation Hardening: No; Number of Pins: 3; Part number: DMG2305UX-13; RoHS: Yes; Max Operating Temperature: 150°C; Width: 1.4mm; Drain to Source Voltage (Vdss): 20V
Q601 Q602 = CMP-ROOT-00113-5: MOSFET N-CH 100V 170MA SOT-23; Manufacturer: ON Semiconductor; Max Power Dissipation: 360mW; On-State Resistance: 6R; Threshold Voltage: 1.7V; Fall Time: 9ns; Input Capacitance: 73pF; Turn-On Delay Time: 1.7ns; Gate to Source Voltage (Vgs): 20V; Turn-Off Delay Time: 17ns; Element Configuration: Single; Number of Elements: 1; Max Operating Temperature: 150°C; Rise Time: 9ns; Nominal Vgs: 1.7V; Height: 0.93mm; Radiation Hardening: No; Power Dissipation: 360mW; Drain to Source Resistance: 6R; Voltage Rating (DC): 100V; Drain to Source Voltage (Vdss): 100V; Package Quantity: 1; Length: 2.92mm; Lead Free: Lead Free; Width: 1.3mm; Drain to Source Breakdown Voltage: 100V; Contact Plating: Tin,Matte; Current Rating: 170mA; Rds On Max: 6R; Dual Supply Voltage: 100V; Voltage: 100V; Number of Pins: 3; Mount: Surface Mount; Part number: BSS123; Continuous Drain Current (ID): 170mA; REACH SVHC: No SVHC; RoHS: Yes; Min Operating Temperature: -55°C; Packaging: Tape and Reel; Case/Package: SOT-23
R600-R607 R612 = CMP-0001-00237-1: Resistor, 0603, 1k, 0.1%, 1/16W; Manufacturer: Any; Mount: SMD; Part number: Any; RoHS: Yes; Case/Package: 0603; Value: 1k
R608 R610 R611 R613 = CMP-001-0101-2: Resistor, 0603, 10k, 1%, 1/10W; Manufacturer: Any; Power: 100mW; Tolerance: 1%; Value: 10k; RoHS: Yes; Mount: SMD; Case/Package: 0603; Part number: Resistor, 0603, 10k, 1%, 1/10W
R609 = CMP-001-0053-3: Resistor, 0603, 100R, 1%, 1/10W; Manufacturer: Any; Value: 100; Power: 100mW; RoHS: Yes; Case/Package: 0603; Tolerance: 1%; Part number: Resistor, 0603, 100R, 1%, 1/10W; Mount: SMD
S600-S607 = CMP-ROOT-01057-1: Switch Push Button OFF (ON) SPST Round Button 0.05A 24VDC Momentary Contact PC Pins Thru-Hole; Manufacturer: TE; Actuator Color: Black; Actuator Length: 0.226inch; Actuator Material: PBT; Actuator Type: Standard; Contact Current Rating: 50mA; Contact Resistance: 100mR; Electrical Life: 100000Cycles; Illumination Type: Non-Illuminated; Max Voltage Rating (DC): 24V; Number of Positions: 2; Operating Force: 160gf; Switch Function: Off-Mom; Switch Travel: 0.25mm; Case/Package: FSMRAJ; Mount: TH; Part number: 1-1825027-1; RoHS: Yes; Color: Black; Contact Material: Copper Alloy; Contact Plating: Silver; Contact Type: 1 maker; Current Rating: 50mA; Depth: 12.36mm; ELV: Compliant; Height: 7.3mm; Illumination Color: Black; Insulation Resistance: 100MR; Lead Free: Lead Free; Length: 7.11mm; Max Current Rating: 50mA; Max Operating Temperature: 85°C; Mechanical Life: 100000Cycles; Min Operating Temperature: -35°C; Mounting Technology: Through Hole; Orientation: Straight; Package Quantity: 1000; Packaging: Loose Piece; Radiation Hardening: No; Reach SVHC Compliant: No; RoHS Compliant: Yes; Series: FSMRAJ, Alcoswitch; Termination: PC Pins; Throw Configuration: SPST; Type: Switch; Voltage Rating (AC): 24V; Width: 6mm
TP600 = CMP-001-1238-1

## Sheet Revision history.SchDoc: Name project title here
size A3; Organization: Krakul OÜ; Address1: Kaare tee 3, lubja; Address2: viimsi vald; Address3: harju maakond; Address4: Estonia 74010; DocumentNumber: No here; Revision: 0; SheetNumber: 7; SheetTotal: 7
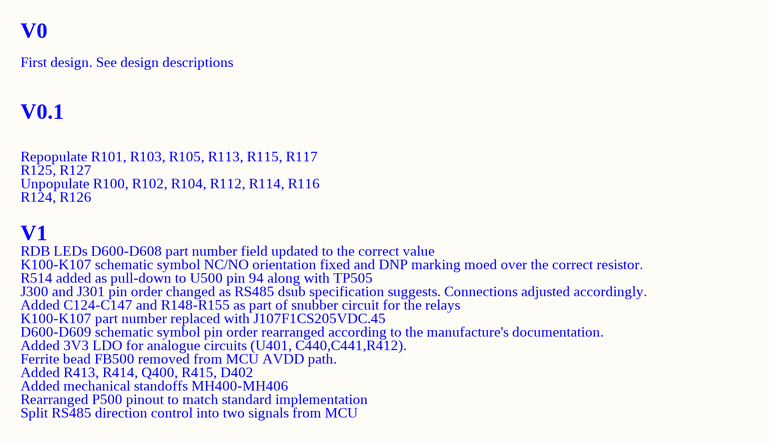
[diagram p7: Revision history.SchDoc]

### Notes on the sheet
- V0
- First design. See design descriptions
- V0.1
- Repopulate R101, R103, R105, R113, R115, R117
- R125, R127
- Unpopulate R100, R102, R104, R112, R114, R116
- R124, R126
- RDB LEDs D600-D608 part number field updated to the correct value
- V1
- K100-K107 schematic symbol NC/NO orientation fixed and DNP marking moed over the correct resistor.
- R514 added as pull-down to U500 pin 94 along with TP505
- J300 and J301 pin order changed as RS485 dsub specification suggests. Connections adjusted accordingly.
- Added C124-C147 and R148-R155 as part of snubber circuit for the relays
- K100-K107 part number replaced with J107F1CS205VDC.45
- D600-D609 schematic symbol pin order rearranged according to the manufacture's documentation.
- Added 3V3 LDO for analogue circuits (U401, C440,C441,R412).
- Ferrite bead FB500 removed from MCU AVDD path.
- Added R413, R414, Q400, R415, D402
- Added mechanical standoffs MH400-MH406
- Rearranged P500 pinout to match standard implementation
- Split RS485 direction control into two signals from MCU
- Title:
- Date:
- Last modified:
- Project:
- Sheet
- Time:
- of
- Size:
- A3
- Engineer:
- Revision:
- Revision date:
- Checked by:

## Nets that join several sheets
+3V3: Ethernet (9 pins), RS485 (C301.2 R302.2 U300.8), Power input (6 pins), MCU (19 pins), LEDs_Switches (10 pins)
+3V3_AN: Power outputs (16 pins), Power input (19 pins), MCU (8 pins)
+5V: Power input (17 pins), LEDs_Switches (Q600.2 R608.2)
GND: Power outputs (88 pins), Ethernet (25 pins), RS485 (9 pins), Power input (71 pins), MCU (38 pins), LEDs_Switches (47 pins)
V+_RELAY: Power outputs (8 pins), Power input (R410.1 R411.1)
BTN_1: MCU (U500.62), LEDs_Switches (C600.2 S600.2)
BTN_2: MCU (U500.61), LEDs_Switches (C601.2 S601.2)
BTN_3: MCU (U500.60), LEDs_Switches (C602.2 S602.2)
BTN_4: MCU (U500.59), LEDs_Switches (C603.2 S603.2)
BTN_5: MCU (U500.58), LEDs_Switches (C604.2 S604.2)
BTN_6: MCU (U500.57), LEDs_Switches (C605.2 S605.2)
BTN_7: MCU (U500.56), LEDs_Switches (C606.2 S606.2)
BTN_8: MCU (U500.55), LEDs_Switches (C607.2 S607.2)
ETH_nRST: Ethernet (R200.2 U200.15), MCU (U500.23)
LED_DATA: MCU (U500.47), LEDs_Switches (Q602.2 R611.1)
LED_PWR_EN: MCU (U500.44), LEDs_Switches (R609.1)
OUT_1_EN: Power outputs (R106.1), MCU (U500.84)
OUT_1_I: Power input (C404.2 U400.7), MCU (U502.4)
OUT_1_PWR: Power outputs (R100.2 R101.2), Power input (U400.3 U400.4)
OUT_1_V: Power outputs (C104.2 D112.3 R133.1 R136.2), MCU (U501.4)
OUT_2_EN: Power outputs (R107.1), MCU (U500.83)
OUT_2_I: Power input (C406.2 U401.7), MCU (U502.5)
OUT_2_PWR: Power outputs (R102.2 R103.2), Power input (U401.3 U401.4)
OUT_2_V: Power outputs (C105.2 D113.3 R134.1 R137.2), MCU (U501.5)
OUT_3_EN: Power outputs (R109.1), MCU (U500.82)
OUT_3_I: Power input (C408.2 U402.7), MCU (U502.6)
OUT_3_PWR: Power outputs (R104.2 R105.2), Power input (U402.3 U402.4)
OUT_3_V: Power outputs (C103.2 D111.3 R132.1 R135.2), MCU (U501.6)
OUT_4_EN: Power outputs (R118.1), MCU (U500.81)
OUT_4_I: Power input (C414.2 U403.7), MCU (U502.7)
OUT_4_PWR: Power outputs (R112.2 R113.2), Power input (U403.3 U403.4)
OUT_4_V: Power outputs (C109.2 D117.3 R138.1 R141.2), MCU (U501.7)
OUT_5_EN: Power outputs (R119.1), MCU (U500.80)
OUT_5_I: Power input (C416.2 U404.7), MCU (U502.12)
OUT_5_PWR: Power outputs (R114.2 R115.2), Power input (U404.3 U404.4)
OUT_5_V: Power outputs (C110.2 D118.3 R139.1 R142.2), MCU (U501.12)
OUT_6_EN: Power outputs (R122.1), MCU (U500.79)
OUT_6_I: Power input (C418.2 U405.7), MCU (U502.11)
OUT_6_PWR: Power outputs (R116.2 R117.2), Power input (U405.3 U405.4)
OUT_6_V: Power outputs (C111.2 D119.3 R140.1 R143.2), MCU (U501.11)
OUT_7_EN: Power outputs (R128.1), MCU (U500.78)
OUT_7_I: Power input (C420.2 U406.7), MCU (U502.10)
OUT_7_PWR: Power outputs (R124.2 R125.2), Power input (U406.3 U406.4)
OUT_7_V: Power outputs (C114.2 D122.3 R144.1 R146.2), MCU (U501.10)
OUT_8_EN: Power outputs (R130.1), MCU (U500.77)
OUT_8_I: Power input (C423.2 U407.7), MCU (U502.9)
OUT_8_PWR: Power outputs (R126.2 R127.2), Power input (U407.3 U407.4)
OUT_8_V: Power outputs (C115.2 D123.3 R145.1 R147.2), MCU (U501.9)
PWR_IN_V_ADC: Power input (C424.2 D400.3 R400.1 R401.2), MCU (U500.18)
RMII_CRS_DV: Ethernet (R207.1), MCU (U500.32)
RMII_MDC: Ethernet (U200.13), MCU (U500.16)
RMII_MDIO: Ethernet (R201.1 U200.12), MCU (U500.25)
RMII_REFCLK: Ethernet (R209.1), MCU (U500.24)
RMII_RXD0: Ethernet (R206.1), MCU (U500.33)
RMII_RXD1: Ethernet (R205.1), MCU (U500.34)
RMII_TXD0: Ethernet (R203.1), MCU (U500.51)
RMII_TXD1: Ethernet (R204.1), MCU (U500.54)
RMII_TXEN: Ethernet (R202.1), MCU (U500.30)
RS485_DIR_DE: RS485 (R306.2 U300.3), MCU (U500.95)
RS485_DIR_RE: RS485 (R307.2 U300.2), MCU (U500.96)
RS485_R: RS485 (R302.1 U300.1), MCU (U500.97)
RS485_T: RS485 (U300.4), MCU (U500.1)

## Assembly variants
Master: not fitted P500 R100 R102 R104 R112 R114 R116 R124 R126 R307 R411 R413 R414 R515 R516 R517 R522 R613